# EAGLE design LIC_rack_backplane-01 (EAGLE 5.06)
AUTHOR: M. Petrilak; VERSION: 0.1

## Sheet 1 of 2
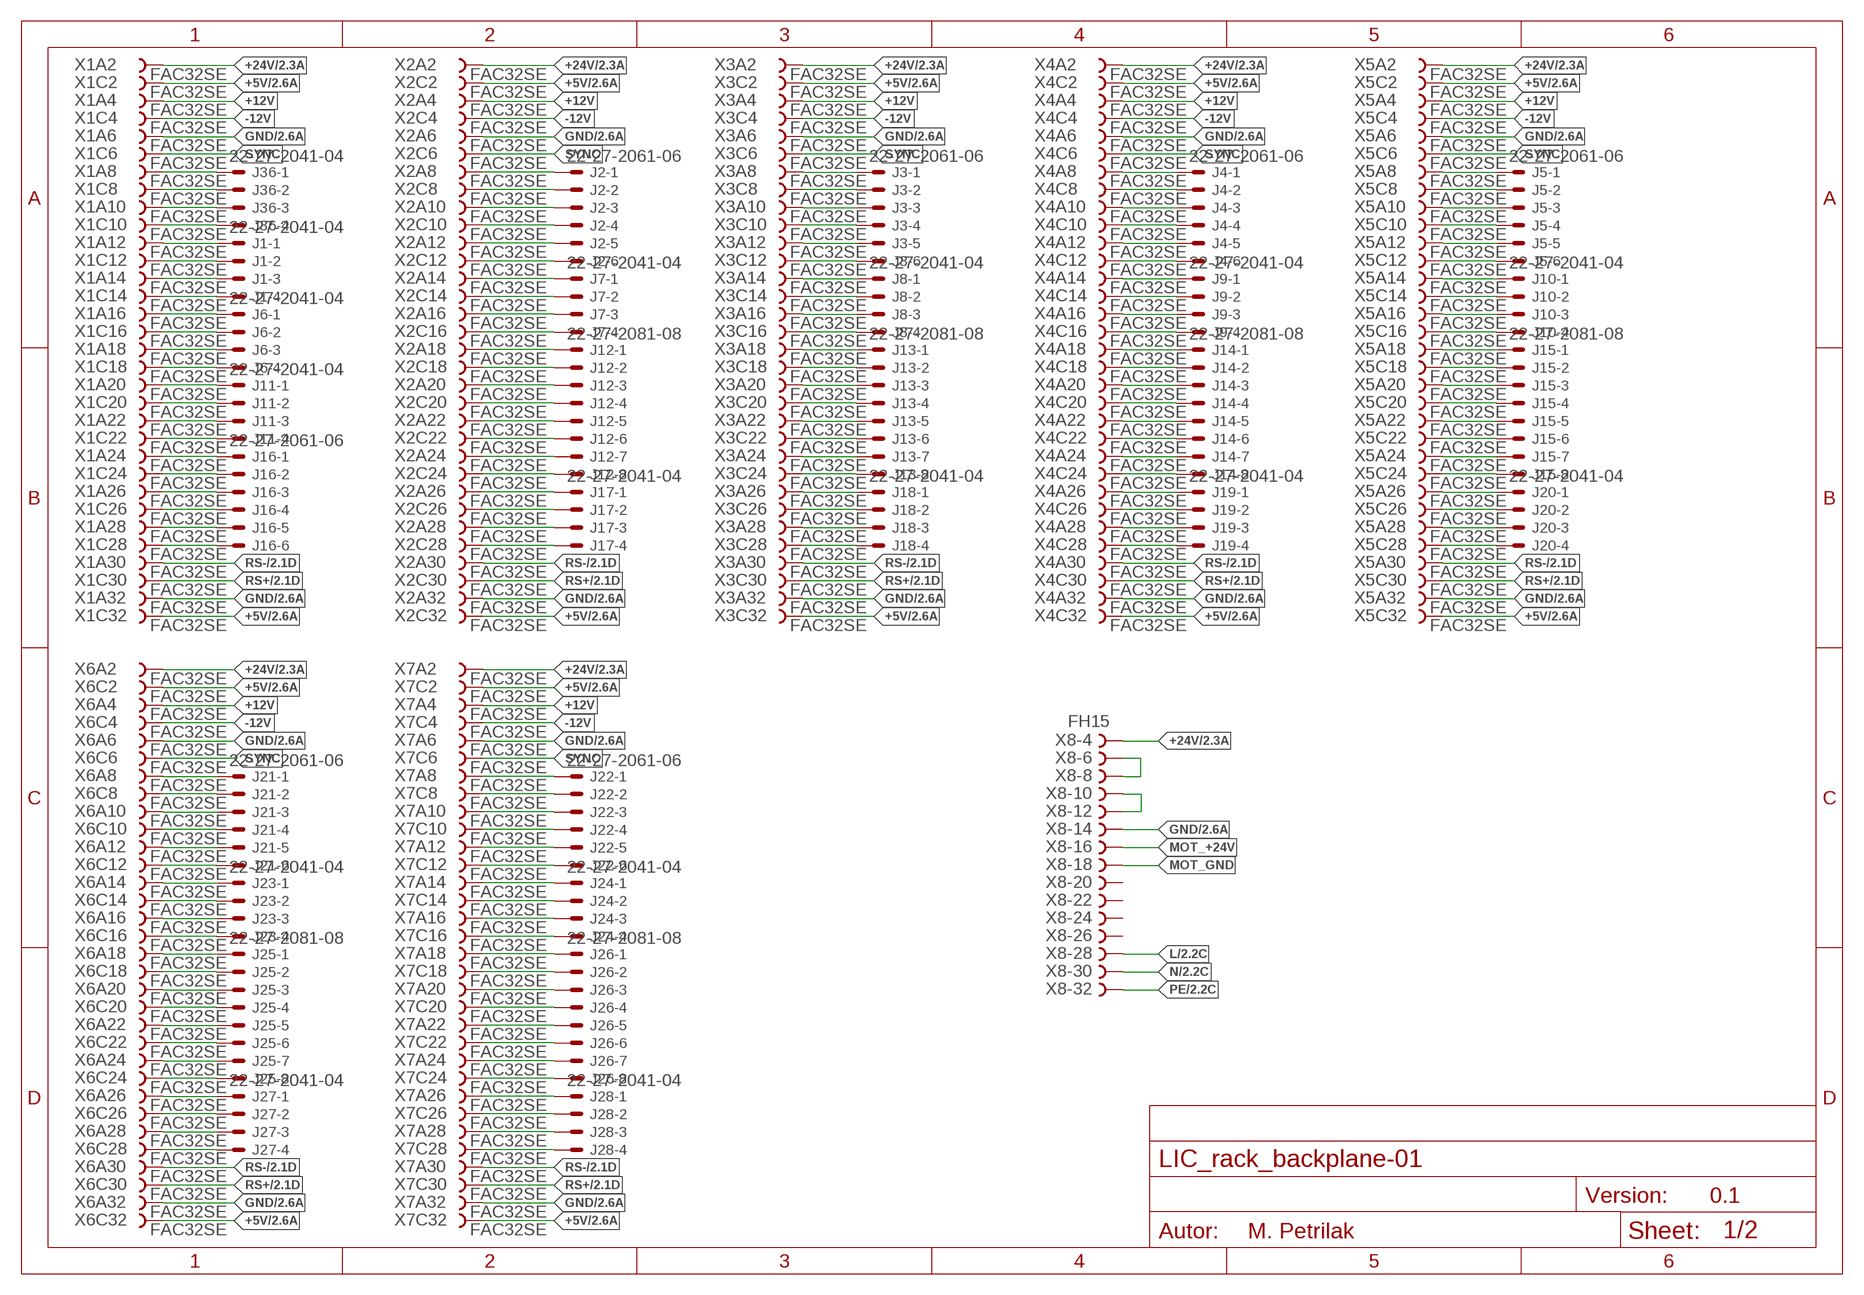
[diagram p0: schematic, sheet 1]

### Parts
J1  22-27-2041-04  [6410-04]
J2  22-27-2061-06  [6410-06]
J3  22-27-2061-06  [6410-06]
J4  22-27-2061-06  [6410-06]
J5  22-27-2061-06  [6410-06]
J6  22-27-2041-04  [6410-04]
J7  22-27-2041-04  [6410-04]
J8  22-27-2041-04  [6410-04]
J9  22-27-2041-04  [6410-04]
J10  22-27-2041-04  [6410-04]
J11  22-27-2041-04  [6410-04]
J12  22-27-2081-08  [6410-08]
J13  22-27-2081-08  [6410-08]
J14  22-27-2081-08  [6410-08]
J15  22-27-2081-08  [6410-08]
J16  22-27-2061-06  [6410-06]
J17  22-27-2041-04  [6410-04]
J18  22-27-2041-04  [6410-04]
J19  22-27-2041-04  [6410-04]
J20  22-27-2041-04  [6410-04]
J21  22-27-2061-06  [6410-06]
J22  22-27-2061-06  [6410-06]
J23  22-27-2041-04  [6410-04]
J24  22-27-2041-04  [6410-04]
J25  22-27-2081-08  [6410-08]
J26  22-27-2081-08  [6410-08]
J27  22-27-2041-04  [6410-04]
J28  22-27-2041-04  [6410-04]
J36  22-27-2041-04  [6410-04]
X1  FAC32SE  [FAC32S]
X2  FAC32SE  [FAC32S]
X3  FAC32SE  [FAC32S]
X4  FAC32SE  [FAC32S]
X5  FAC32SE  [FAC32S]
X6  FAC32SE  [FAC32S]
X7  FAC32SE  [FAC32S]
X8  FH15  [FH15]

### Nets
+5V: X1.C2 X1.C32 X2.C2 X2.C32 X3.C2 X3.C32 X4.C2 X4.C32 X5.C2 X5.C32 X6.C2 X6.C32 X7.C2 X7.C32 ; also sheet 2
+12V: X1.A4 X2.A4 X3.A4 X4.A4 X5.A4 X6.A4 X7.A4
+24V: X1.A2 X2.A2 X3.A2 X4.A2 X5.A2 X6.A2 X7.A2 X8.4 ; also sheet 2
-12V: X1.C4 X2.C4 X3.C4 X4.C4 X5.C4 X6.C4 X7.C4
GND: X1.A6 X1.A32 X2.A6 X2.A32 X3.A6 X3.A32 X4.A6 X4.A32 X5.A6 X5.A32 X6.A6 X6.A32 X7.A6 X7.A32 X8.14 ; also sheet 2
L [LNPE]: X8.28 ; also sheet 2
MOT_+24V: X8.16
MOT_GND: X8.18
N [LNPE]: X8.30 ; also sheet 2
N$1: X8.6 X8.8
N$2: X8.10 X8.12
N$3: J16.3 X1.A26
N$4: J16.4 X1.C26
N$5: J16.5 X1.A28
N$6: J2.1 X2.A8
N$7: J2.2 X2.C8
N$8: J2.3 X2.A10
N$9: J2.4 X2.C10
N$10: J2.5 X2.A12
N$11: J2.6 X2.C12
N$12: J7.1 X2.A14
N$13: J1.1 X1.A12
N$14: J1.2 X1.C12
N$15: J1.3 X1.A14
N$16: J1.4 X1.C14
N$17: J6.1 X1.A16
N$18: J13.2 X3.C18
N$19: J13.3 X3.A20
N$20: J13.4 X3.C20
N$21: J13.5 X3.A22
N$22: J13.6 X3.C22
N$23: J13.7 X3.A24
N$24: J13.8 X3.C24
N$25: J18.1 X3.A26
N$26: J18.2 X3.C26
N$27: J18.3 X3.A28
N$28: J18.4 X3.C28
N$29: J16.6 X1.C28
N$30: J36.1 X1.A8
N$31: J36.2 X1.C8
N$32: J36.3 X1.A10
N$33: J36.4 X1.C10
N$34: J6.2 X1.C16
N$35: J6.3 X1.A18
N$36: J6.4 X1.C18
N$37: J11.1 X1.A20
N$38: J11.2 X1.C20
N$39: J11.3 X1.A22
N$40: J11.4 X1.C22
N$41: J16.1 X1.A24
N$42: J16.2 X1.C24
N$43: J14.2 X4.C18
N$44: J14.3 X4.A20
N$45: J14.4 X4.C20
N$46: J14.5 X4.A22
N$47: J14.6 X4.C22
N$48: J14.7 X4.A24
N$49: J14.8 X4.C24
N$50: J19.1 X4.A26
N$51: J19.2 X4.C26
N$52: J19.3 X4.A28
N$53: J19.4 X4.C28
N$54: J15.2 X5.C18
N$55: J15.3 X5.A20
N$56: J15.4 X5.C20
N$57: J15.5 X5.A22
N$58: J15.6 X5.C22
N$59: J15.7 X5.A24
N$60: J15.8 X5.C24
N$61: J20.1 X5.A26
N$62: J20.2 X5.C26
N$63: J20.3 X5.A28
N$64: J20.4 X5.C28
N$65: J25.2 X6.C18
N$66: J25.3 X6.A20
N$67: J25.4 X6.C20
N$68: J25.5 X6.A22
N$69: J25.6 X6.C22
N$70: J25.7 X6.A24
N$71: J25.8 X6.C24
N$72: J27.1 X6.A26
N$73: J27.2 X6.C26
N$74: J27.3 X6.A28
N$75: J27.4 X6.C28
N$76: J7.2 X2.C14
N$77: J7.3 X2.A16
N$78: J7.4 X2.C16
N$79: J17.1 X2.A26
N$80: J17.2 X2.C26
N$81: J17.3 X2.A28
N$82: J17.4 X2.C28
N$83: J12.1 X2.A18
N$84: J12.2 X2.C18
N$85: J12.3 X2.A20
N$86: J12.4 X2.C20
N$87: J12.5 X2.A22
N$88: J12.6 X2.C22
N$89: J12.7 X2.A24
N$90: J12.8 X2.C24
N$99: J22.1 X7.A8
N$100: J22.2 X7.C8
N$101: J22.3 X7.A10
N$102: J22.4 X7.C10
N$103: J22.5 X7.A12
N$104: J22.6 X7.C12
N$105: J24.1 X7.A14
N$120: J24.2 X7.C14
N$121: J24.3 X7.A16
N$122: J24.4 X7.C16
N$123: J28.1 X7.A26
N$124: J28.2 X7.C26
N$125: J28.3 X7.A28
N$126: J28.4 X7.C28
N$127: J26.1 X7.A18
N$128: J26.2 X7.C18
N$129: J26.3 X7.A20
N$130: J26.4 X7.C20
N$131: J26.5 X7.A22
N$132: J26.6 X7.C22
N$133: J26.7 X7.A24
N$134: J26.8 X7.C24
PE [LNPE]: X8.32 ; also sheet 2
RS+: X1.C30 X2.C30 X3.C30 X4.C30 X5.C30 X6.C30 X7.C30 ; also sheet 2
RS-: X1.A30 X2.A30 X3.A30 X4.A30 X5.A30 X6.A30 X7.A30 ; also sheet 2
SYNC: X1.C6 X2.C6 X3.C6 X4.C6 X5.C6 X6.C6 X7.C6
U_01_01: J3.1 X3.A8
U_01_02: J3.2 X3.C8
U_01_03: J3.3 X3.A10
U_01_04: J3.4 X3.C10
U_01_05: J3.5 X3.A12
U_01_06: J3.6 X3.C12
U_01_07: J8.1 X3.A14
U_01_08: J8.2 X3.C14
U_01_09: J8.3 X3.A16
U_01_10: J8.4 X3.C16
U_01_11: J13.1 X3.A18
U_01_12: J4.1 X4.A8
U_01_13: J4.2 X4.C8
U_01_14: J4.3 X4.A10
U_01_15: J4.4 X4.C10
U_01_16: J4.5 X4.A12
U_01_17: J4.6 X4.C12
U_01_18: J9.1 X4.A14
U_01_19: J9.2 X4.C14
U_01_20: J9.3 X4.A16
U_01_21: J9.4 X4.C16
U_01_22: J14.1 X4.A18
U_01_23: J5.1 X5.A8
U_01_24: J5.2 X5.C8
U_01_25: J5.3 X5.A10
U_01_26: J5.4 X5.C10
U_01_27: J5.5 X5.A12
U_01_28: J5.6 X5.C12
U_01_29: J10.1 X5.A14
U_01_30: J10.2 X5.C14
U_01_31: J10.3 X5.A16
U_01_32: J10.4 X5.C16
U_01_33: J15.1 X5.A18
U_01_34: J21.1 X6.A8
U_01_35: J21.2 X6.C8
U_01_36: J21.3 X6.A10
U_01_37: J21.4 X6.C10
U_01_38: J21.5 X6.A12
U_01_39: J21.6 X6.C12
U_01_40: J23.1 X6.A14
U_01_41: J23.2 X6.C14
U_01_42: J23.3 X6.A16
U_01_43: J23.4 X6.C16
U_01_44: J25.1 X6.A18
Unconnected: X8.20 X8.22 X8.24 X8.26

## Sheet 2 of 2
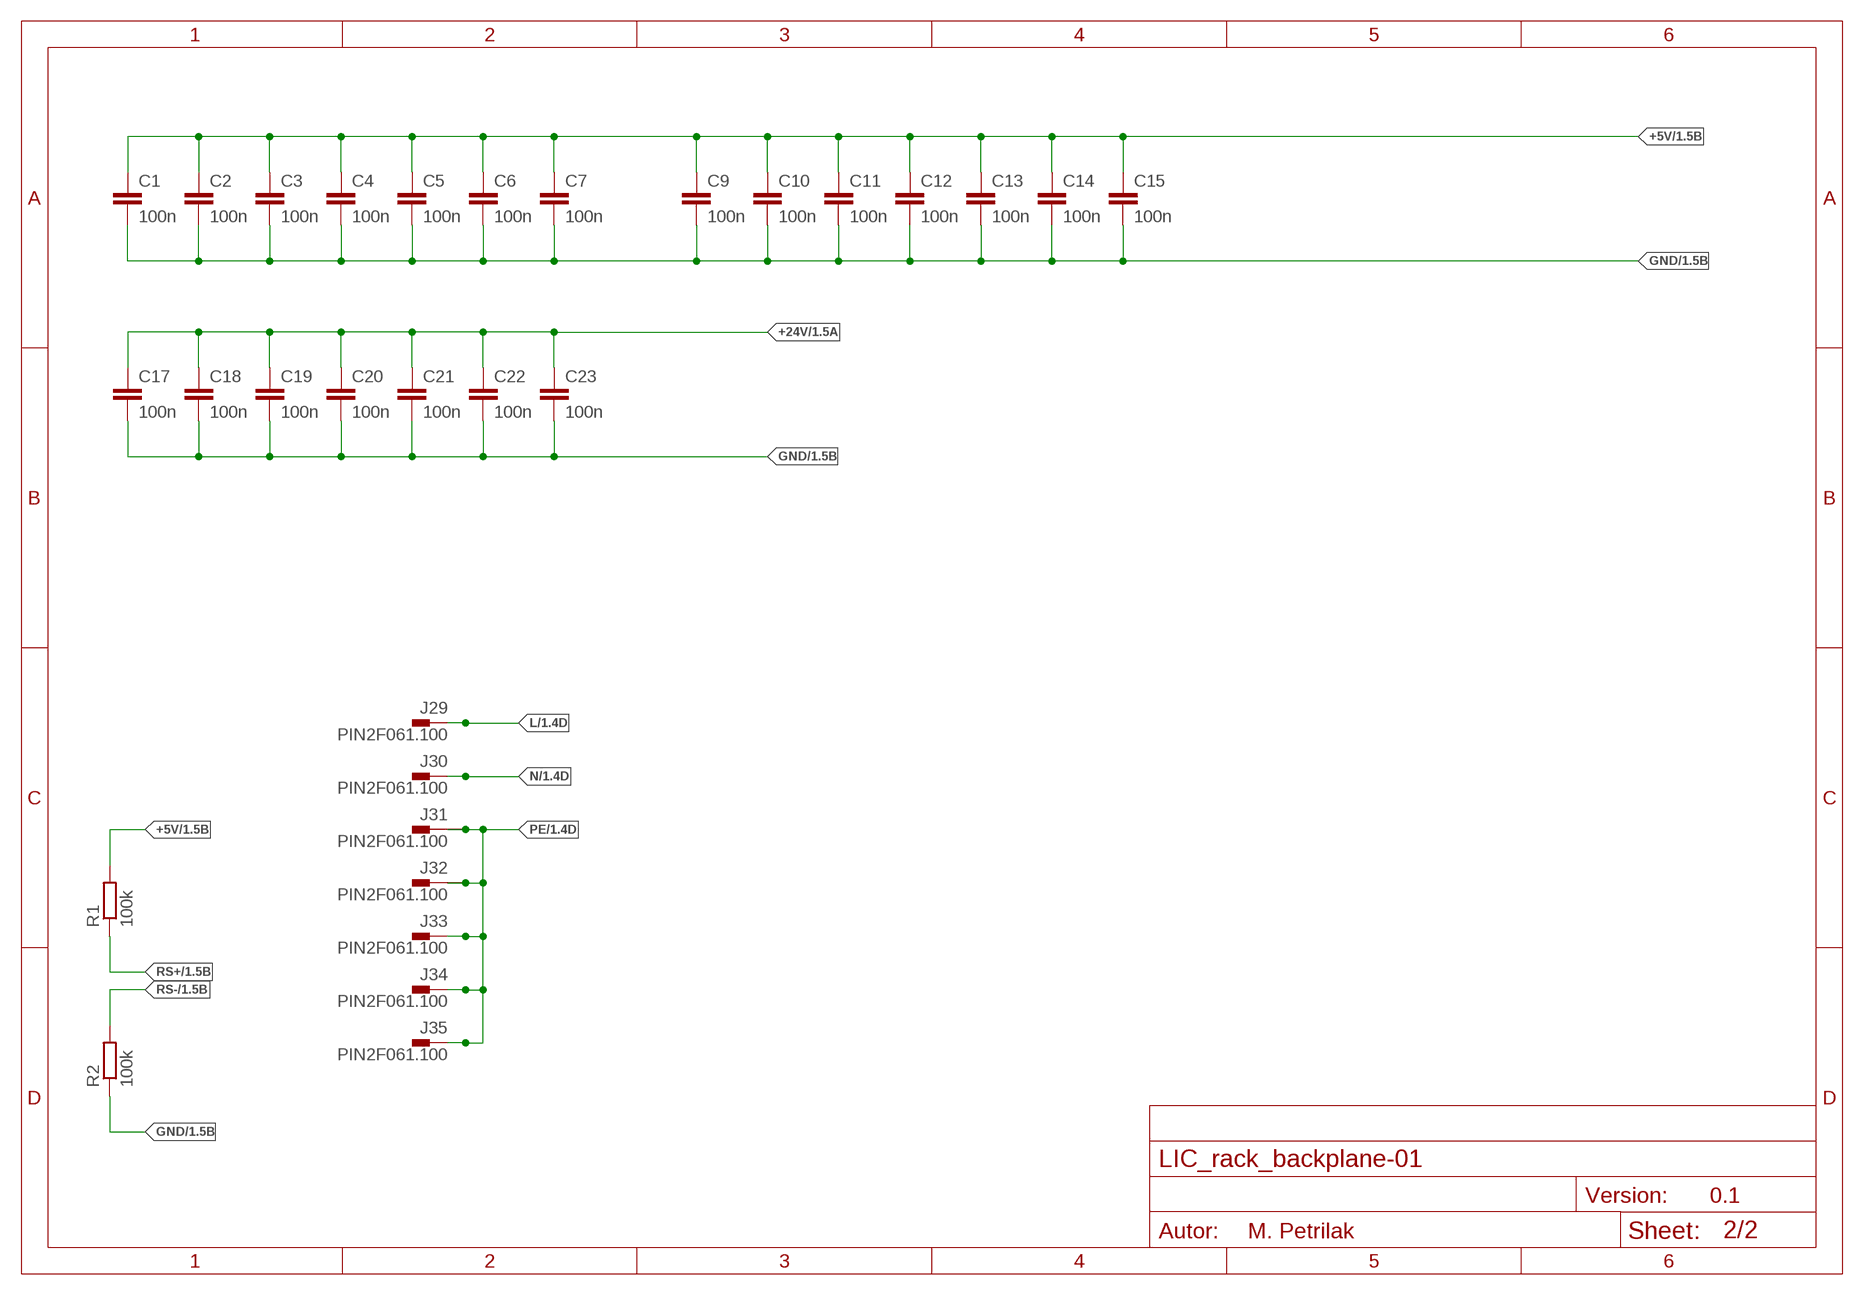
[diagram p1: schematic, sheet 2]

### Parts
C1  100n  C-EUC1206  [C1206]
C2  100n  C-EUC1206  [C1206]
C3  100n  C-EUC1206  [C1206]
C4  100n  C-EUC1206  [C1206]
C5  100n  C-EUC1206  [C1206]
C6  100n  C-EUC1206  [C1206]
C7  100n  C-EUC1206  [C1206]
C9  100n  C-EUC1206  [C1206]
C10  100n  C-EUC1206  [C1206]
C11  100n  C-EUC1206  [C1206]
C12  100n  C-EUC1206  [C1206]
C13  100n  C-EUC1206  [C1206]
C14  100n  C-EUC1206  [C1206]
C15  100n  C-EUC1206  [C1206]
C17  100n  C-EUC1206  [C1206]
C18  100n  C-EUC1206  [C1206]
C19  100n  C-EUC1206  [C1206]
C20  100n  C-EUC1206  [C1206]
C21  100n  C-EUC1206  [C1206]
C22  100n  C-EUC1206  [C1206]
C23  100n  C-EUC1206  [C1206]
J29  PIN2F061.100  [F061.100]
J30  PIN2F061.100  [F061.100]
J31  PIN2F061.100  [F061.100]
J32  PIN2F061.100  [F061.100]
J33  PIN2F061.100  [F061.100]
J34  PIN2F061.100  [F061.100]
J35  PIN2F061.100  [F061.100]
R1  100k  R-EU_R1206  [R1206]
R2  100k  R-EU_R1206  [R1206]

### Nets
+5V: C1.1 C2.1 C3.1 C4.1 C5.1 C6.1 C7.1 C9.1 C10.1 C11.1 C12.1 C13.1 C14.1 C15.1 R1.2 ; also sheet 1
+24V: C17.1 C18.1 C19.1 C20.1 C21.1 C22.1 C23.1 ; also sheet 1
GND: C1.2 C2.2 C3.2 C4.2 C5.2 C6.2 C7.2 C9.2 C10.2 C11.2 C12.2 C13.2 C14.2 C15.2 C17.2 C18.2 C19.2 C20.2 C21.2 C22.2 C23.2 R2.1 ; also sheet 1
L [LNPE]: J29.A1 J29.A2(1.1) ; also sheet 1
N [LNPE]: J30.A1 J30.A2(1.1) ; also sheet 1
PE [LNPE]: J31.A1 J31.A2(1.1) J32.A1 J32.A2(1.1) J33.A1 J33.A2(1.1) J34.A1 J34.A2(1.1) J35.A1 J35.A2(1.1) ; also sheet 1
RS+: R1.1 ; also sheet 1
RS-: R2.2 ; also sheet 1

## Library data of the parts
C1-C7 C9-C15 C17-C23 = rcl:C-EU: CAPACITOR, European symbol
J1 J6-J11 J17-J20 J23 J24 J27 J28 J36 = con-molex:22-?-04: CONNECTOR wire to board 2.54 mm (.1 inch) pitch header
J2-J5 J16 J21 J22 = con-molex:22-?-06: CONNECTOR wire to board 2.54 mm (.1 inch) pitch header
J12-J15 J25 J26 = con-molex:22-?-08: CONNECTOR wire to board 2.54 mm (.1 inch) pitch header
J29-J35 = con-faston:PIN2: Flachstecker Typ Tyco/Electronics/AMP TAB, FASTON Printed Circuit Board Tabs Source: http://www.buerklin.com, http://catalog.tycoelectronics.com
R1 R2 = rcl:R-EU_: RESISTOR, European symbol
X1-X7 = con-vg:FAC32SE: CONNECTOR female, 32 pins, single, type D, rows AC, grid 5.08 mm
X8 = con-vg:FH15: CONNECTOR female, 15 pins, type H, rows DZ

## Net classes
0 default: clearance 0.2 mm
1 LNPE: clearance 2.5 mm to class 0, clearance 1 mm

## Board
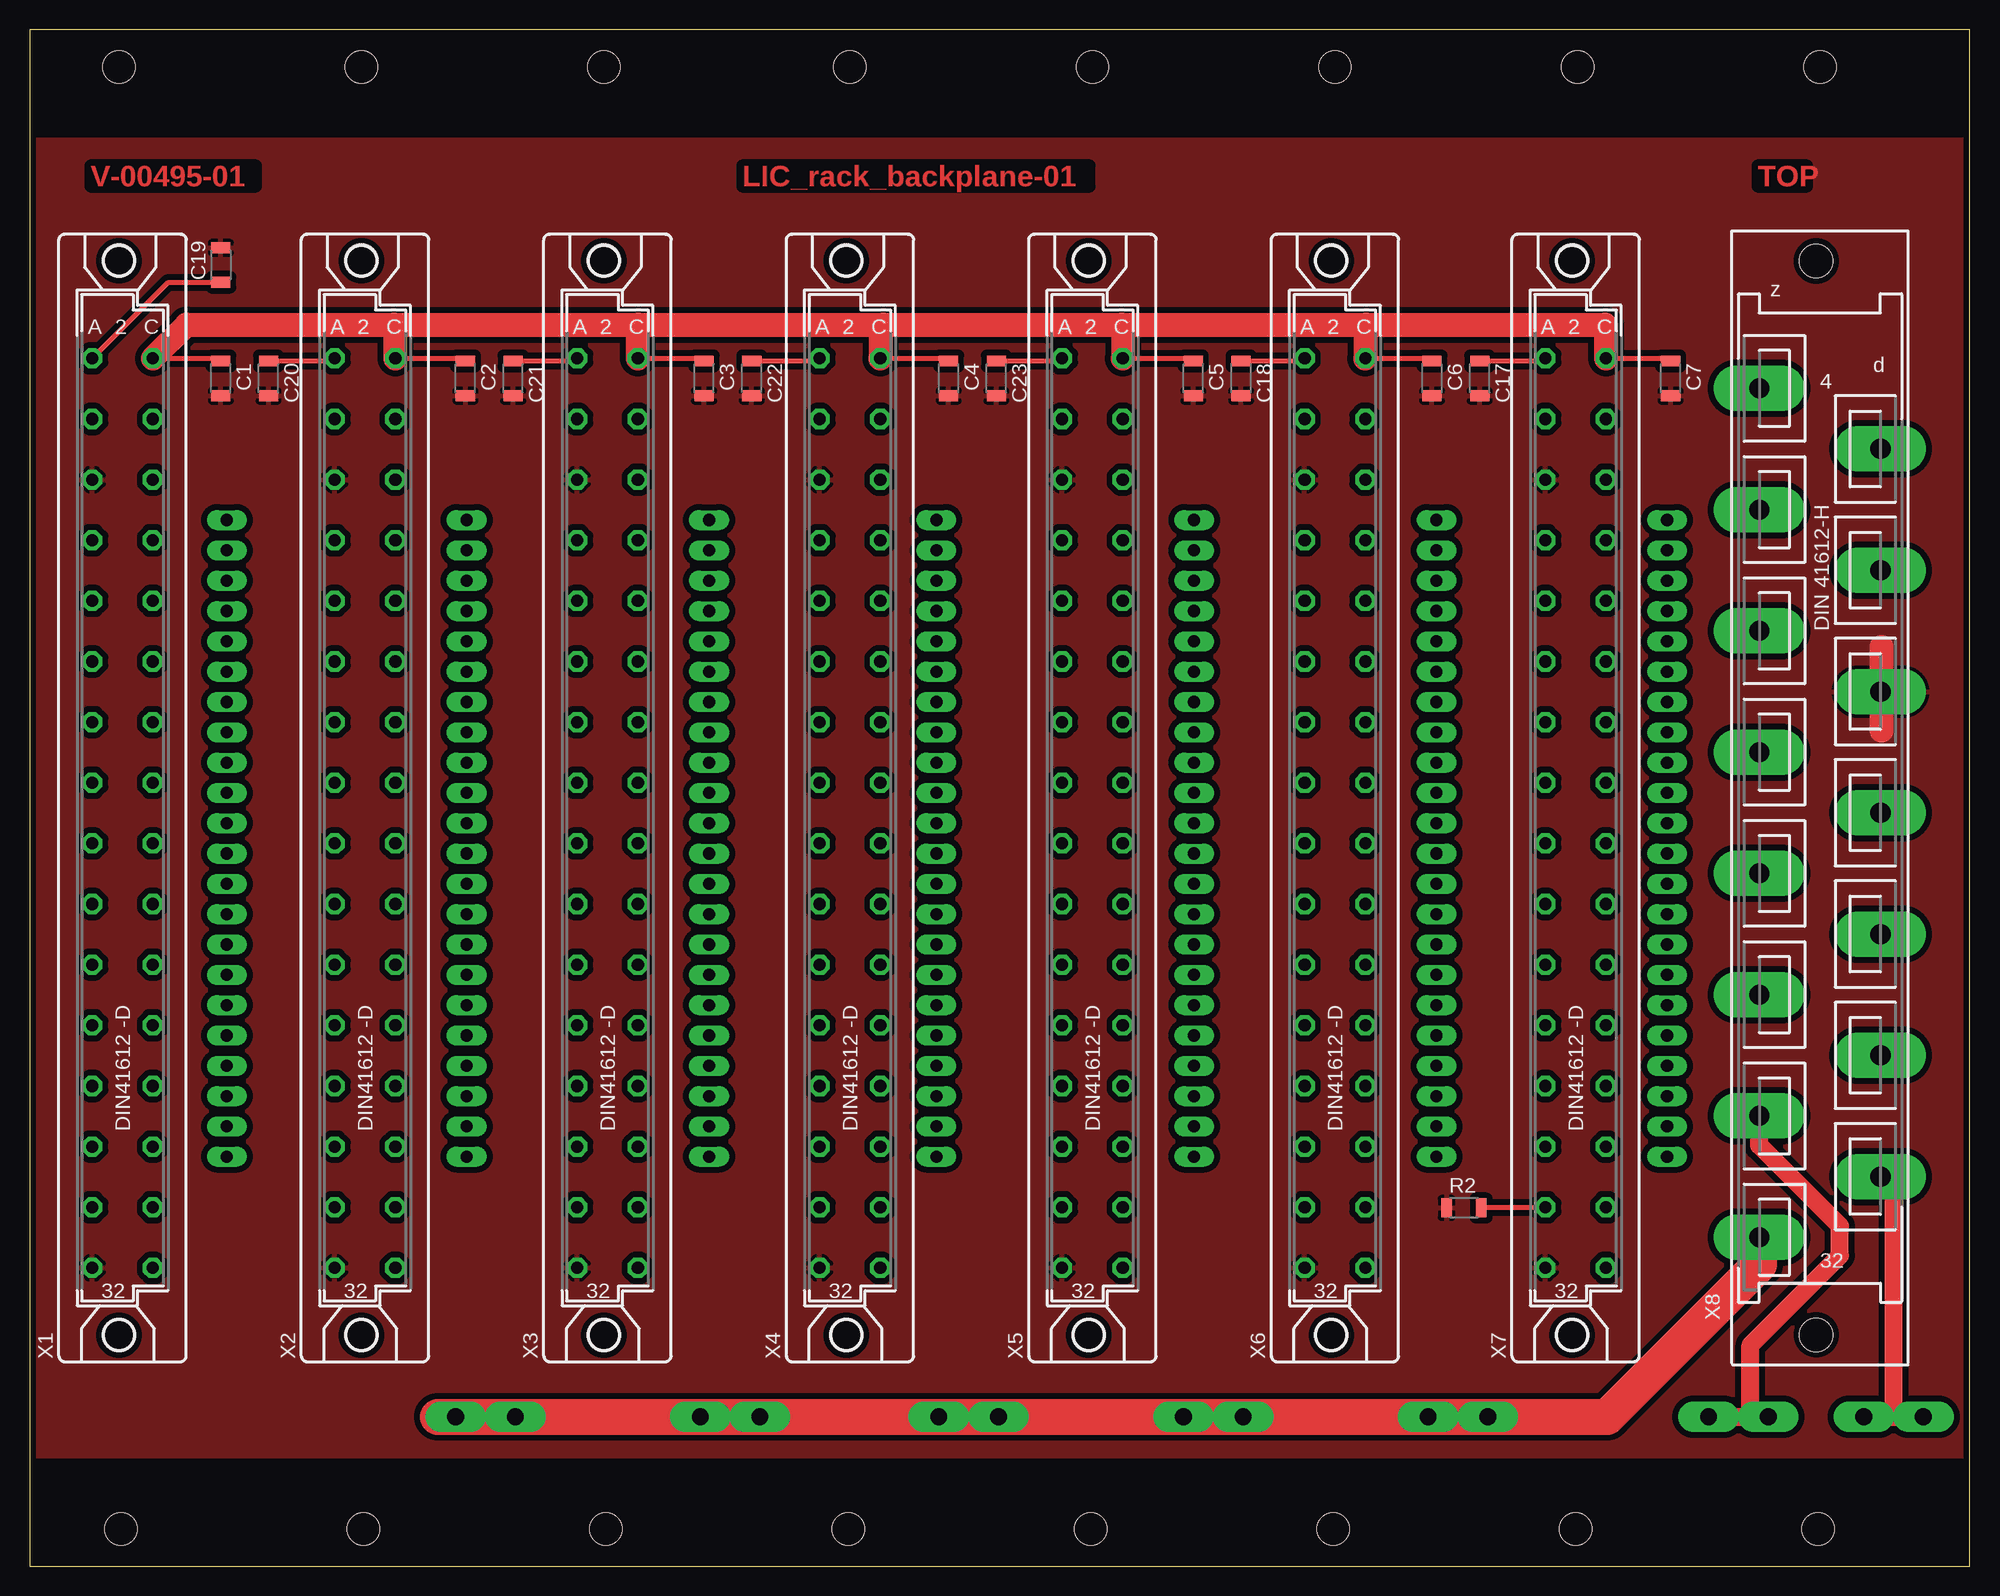
[diagram p2: board, top side]
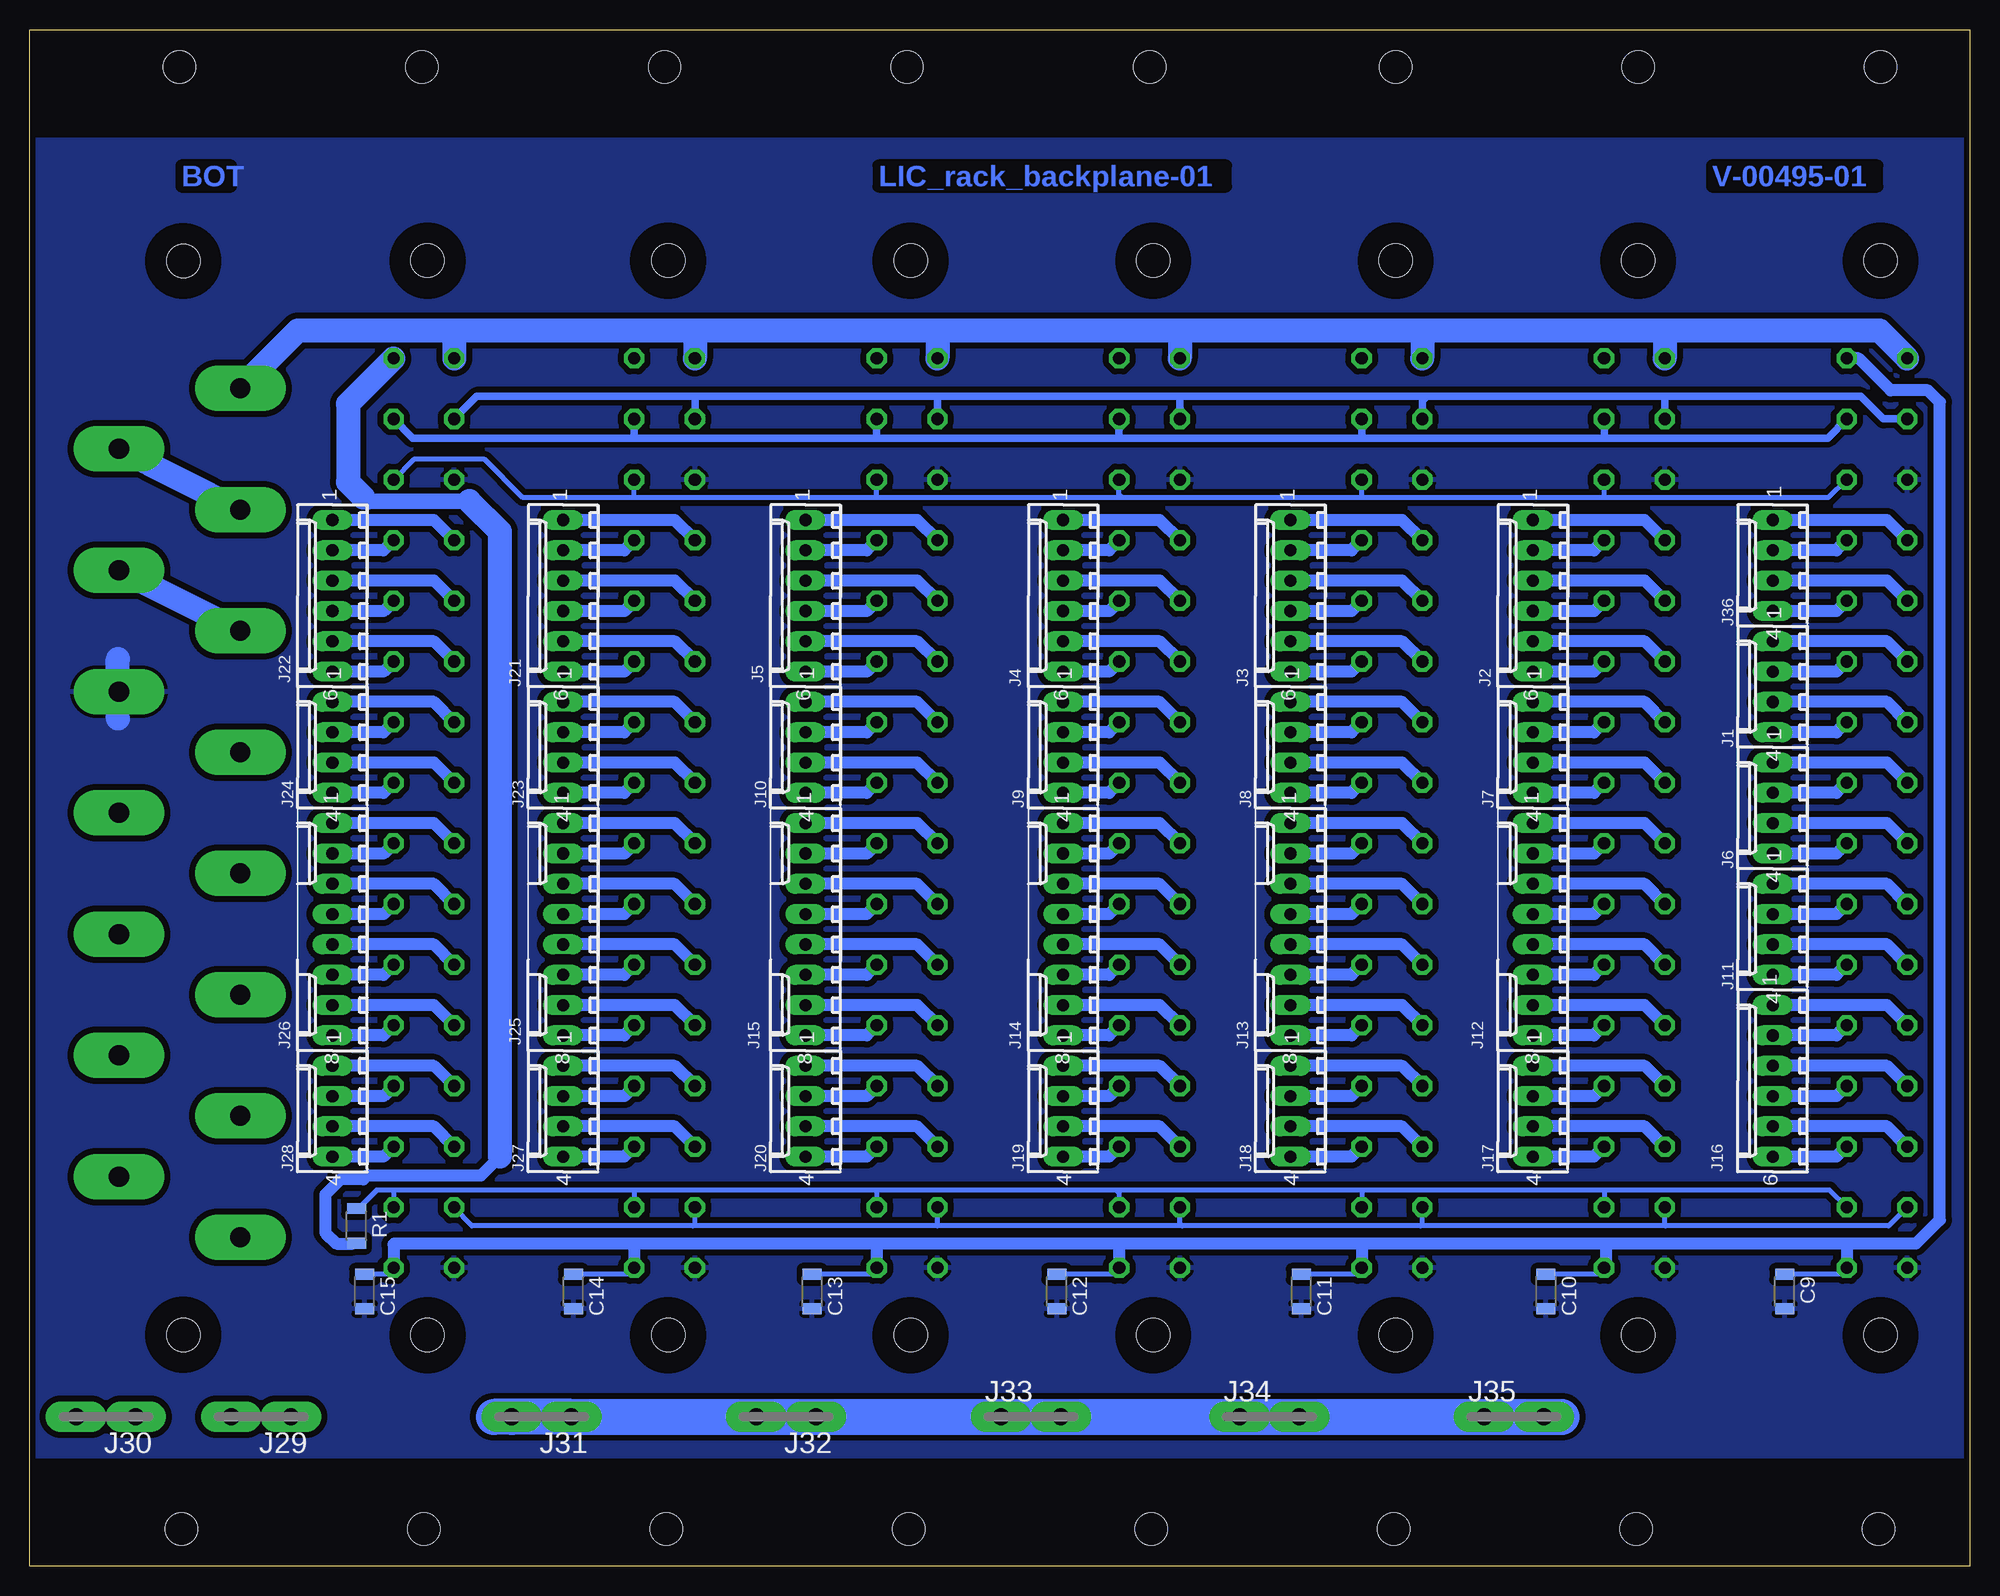
[diagram p3: board, bottom side, seen from below]

Size 162.56 x 128.7 mm. Coordinates in mm from the lower left corner, seen from the top.
Outline: 0,0 162.56,0 162.56,128.7 0,128.7 0,0
Copper layers (1*16): Top 0.04mm / dielectric 1.5mm / Bottom 0.04mm
Design rules "mucha_navrh *": minimum track width 0.2mm, minimum drill 0.6mm, track to track 0.5mm, track to pad 0.5mm, pad to pad 0.3mm, via to via 0.3mm, smd to smd 0mil, copper to edge 0.5mm, drill to drill 0.5mm, minimum pad ring 0.3mm, minimum via ring 0.3mm, stop-mask expansion 0.1mm, vias tented up to drill 0.8mm, thermal gap 0.3mm
Holes 2.7 mm at 7.47,125.6 27.79,125.6 48.11,125.6 68.73,125.6 7.62,3.1 89.05,125.6 109.37,125.6 129.69,125.6 150.01,125.6 27.94,3.1 48.26,3.1 68.58,3.1 88.9,3.1 109.22,3.1 129.54,3.1 149.86,3.1
tRestrict: area 0,119.7 to 182.9,128.7; area 0,0 to 182.9,9
bRestrict: area 0,119.7 to 182.9,128.7; area 0,0 to 182.9,9
vRestrict: area 0,119.7 to 182.9,128.7; area 0,0 to 182.9,9

### Footprints (pad centres in the part's own frame; a part is rotated, then mirrored left to right if it is on the bottom)
C1206 = smd 0.9 x 1.6: 1 -1.45,0; 2 1.45,0
6410-04 = drill 1.016 long: 1 3.81,0; 2 1.27,0; 3 -1.27,0; 4 -3.81,0
6410-06 = drill 1.016 long: 1 6.35,0; 2 3.81,0; 3 1.27,0; 4 -1.27,0; 5 -3.81,0; 6 -6.35,0
6410-08 = drill 1.016 long: 1 8.89,0; 2 6.35,0; 3 3.81,0; 4 1.27,0; 5 -1.27,0; 6 -3.81,0; 7 -6.35,0; 8 -8.89,0
F061.100 = drill 1.4 pad 2.54 long: A1 -2.5,0; A2 2.5,0
R1206 = smd 0.9 x 1.6: 1 -1.45,0; 2 1.45,0
FAC32S = drill 1.016 octagon: A2 -2.54,36.83; A4 -2.54,31.75; A6 -2.54,26.67; A8 -2.54,21.59; A10 -2.54,16.51; A12 -2.54,11.43; A14 -2.54,6.35; A16 -2.54,1.27; A18 -2.54,-3.81; A20 -2.54,-8.89; A22 -2.54,-13.97; A24 -2.54,-19.05; A26 -2.54,-24.13; A28 -2.54,-29.21; A30 -2.54,-34.29; A32 -2.54,-39.37; C2 2.54,36.83; C4 2.54,31.75; C6 2.54,26.67; C8 2.54,21.59; C10 2.54,16.51; C12 2.54,11.43; C14 2.54,6.35; C16 2.54,1.27; C18 2.54,-3.81; C20 2.54,-8.89; C22 2.54,-13.97; C24 2.54,-19.05; C26 2.54,-24.13; C28 2.54,-29.21; C30 2.54,-34.29; C32 2.54,-39.37 | hole 2.794: -0.305,45.009; -0.305,-45.009
FH15 = drill 1.676 pad 3.81 long: 4 -5.08,34.315; 6 5.08,29.235; 8 -5.08,24.155; 10 5.08,19.075; 12 -5.08,13.995; 14 5.08,8.915; 16 -5.08,3.835; 18 5.08,-1.245; 20 -5.08,-6.325; 22 5.08,-11.405; 24 -5.08,-16.485; 26 5.08,-21.565; 28 -5.08,-26.645; 30 5.08,-31.725; 32 -5.08,-36.805 | hole 2.794: -0.305,44.983; -0.305,-44.983

### Placement (x,y rotation side)
C1  16,99.5 270 top
C2  36.5,99.5 270 top
C3  56.5,99.5 270 top
C4  77,99.5 270 top
C5  97.5,99.5 270 top
C6  117.5,99.5 270 top
C7  137.5,99.5 270 top
C9  15.5,23 270 bottom
C10  35.5,23 270 bottom
C11  56,23 270 bottom
C12  76.5,23 270 bottom
C13  97,23 270 bottom
C14  117,23 270 bottom
C15  134.5,23 270 bottom
C17  121.5,99.5 270 top
C18  101.5,99.5 270 top
C19  16,109 90 top
C20  20,99.5 270 top
C21  40.5,99.5 270 top
C22  60.5,99.5 270 top
C23  81,99.5 270 top
J1  16.51,73.66 90 bottom
J2  36.6,81.28 90 bottom
J3  56.92,81.28 90 bottom
J4  75.97,81.28 90 bottom
J5  97.56,81.28 90 bottom
J6  16.51,63.5 90 bottom
J7  36.6,68.58 90 bottom
J8  56.92,68.58 90 bottom
J9  75.97,68.58 90 bottom
J10  97.56,68.58 90 bottom
J11  16.51,53.34 90 bottom
J12  36.6,53.34 90 bottom
J13  56.92,53.34 90 bottom
J14  75.97,53.34 90 bottom
J15  97.56,53.34 90 bottom
J16  16.51,40.64 90 bottom
J17  36.6,38.1 90 bottom
J18  56.92,38.1 90 bottom
J19  75.97,38.1 90 bottom
J20  97.56,38.1 90 bottom
J21  117.88,81.28 90 bottom
J22  137.2,81.28 90 bottom
J23  117.88,68.58 90 bottom
J24  137.2,68.58 90 bottom
J25  117.88,53.34 90 bottom
J26  137.2,53.34 90 bottom
J27  117.88,38.1 90 bottom
J28  137.2,38.1 90 bottom
J29  143.18,12.5 180 bottom
J30  156.18,12.5 180 bottom
J31  119.68,12.5 180 bottom
J32  99.18,12.5 180 bottom
J33  78.68,12.5 0 bottom
J34  58.68,12.5 0 bottom
J35  38.18,12.5 0 bottom
J36  16.51,83.82 90 bottom
R1  135.18,28.5 270 bottom
R2  120.18,30 0 top
X1  7.77,64.35 0 top
X2  28.09,64.35 0 top
X3  48.41,64.35 0 top
X4  68.73,64.35 0 top
X5  89.05,64.35 0 top
X6  109.37,64.35 0 top
X7  129.54,64.35 0 top
X8  150.01,64.35 0 top

### Tracks (layer width: path | path; a pad name or v marks a point on that pad's centre or on a via)
+5V
  Top 0.406: X7.C2 136.77,101.18 C7.1 | X6.C2 116.77,101.18 C6.1 | X5.C2 97.27,101.18 C5.1 | X4.C2 76.77,101.18 C4.1 | X3.C2 56.27,101.18 C3.1 | X2.C2 36.27,101.18 C2.1 | C1.1 15.77,101.18 X1.C2
  Top 2: X1.C2 13.13,104 30.5,104 | 30.5,104 51,104 | 51,104 71.5,104 | 71.5,104 91.5,104 | 91.5,104 112,104 | 112,104 132,104 132.08,103.92 X7.C2 | X6.C2 111.91,103.91 112,104 | X5.C2 91.59,103.91 91.5,104 | X4.C2 71.27,103.77 71.5,104 | X3.C2 50.95,103.95 51,104 | X2.C2 30.63,103.87 30.5,104
  Bottom 0.406: X7.C32 132.61,24.45 C15.1 | X6.C32 112.44,24.45 C14.1 | X5.C32 92.12,24.45 C13.1 | X4.C32 71.8,24.45 C12.1 | X3.C32 51.48,24.45 C11.1 | X2.C32 31.16,24.45 C10.1 | X1.C32 10.84,24.45 C9.1 | R1.2 135.05,27.05 135.5,27
  Bottom 1: X2.C32 30.5,25.11 30.5,27 | 30.5,27 51,27 | 51,27 71,27 | 71,27 91.5,27 | 91.5,27 112,27 | 112,27 132,27 132.08,26.92 X7.C32 | X5.C32 91.59,26.91 91.5,27 | X6.C32 111.91,26.91 112,27 | X4.C32 71.27,26.73 71,27 | X3.C32 50.95,26.95 51,27 | 10.5,27 4.5,27 2.5,29 2.5,97.5 3.5,98.5 6.63,98.5 9.31,101.18 X1.C2 | 10.5,27 30.5,27 | X1.C32 10.31,26.81 10.5,27 | 135.5,27 136.85,27 137.79,27.94 137.79,31.11 136.53,32.38 134.62,32.38 134.3,32.7 124.78,32.7 123.19,34.29
  Bottom 1.3: 134.3,89.22 125.73,89.22
  Bottom 1.5: 134.62,89.53 134.3,89.22
  Bottom 2: X7.C2 135.89,97.37 135.89,90.81 134.62,89.53 | 125.73,89.22 123.19,86.68 123.19,34.29
+12V
  Bottom 0.61: 25.5,98 9.13,98 7.23,96.1 X1.A4 | 25.5,98 45.5,98 | 45.5,98 66,98 | 66,98 86.5,98 | 86.5,98 107,98 | X2.A4 25.55,97.95 25.5,98 | X3.A4 45.87,97.63 45.5,98 | X4.A4 66.19,97.81 66,98 | X5.A4 86.51,97.99 86.5,98 | X6.A4 106.83,97.83 107,98 | 107,98 125.1,98 X7.A4
+24V
  Top 0.406: C17.1 126.77,100.95 X7.A2 | C18.1 106.6,100.95 X6.A2 | C23.1 86.28,100.95 X5.A2 | C22.1 65.96,100.95 X4.A2 | C21.1 45.64,100.95 X3.A2 | C20.1 25.32,100.95 X2.A2 | C19.1 11.6,107.55 X1.A2
  Bottom 2: 25.5,103.5 45.5,103.5 | 45.5,103.5 66,103.5 | 66,103.5 86.5,103.5 | 86.5,103.5 107,103.5 | 107,103.5 127,103.5 | X3.A2 45.87,103.13 45.5,103.5 | X2.A2 25.55,103.45 25.5,103.5 | X4.A2 66.19,103.31 66,103.5 | X5.A2 86.51,103.49 86.5,103.5 | X6.A2 106.83,103.33 107,103.5 | 127,103.5 X7.A2 | X8.4 140.09,103.5 127,103.5 | 25.5,103.5 7.55,103.5 X1.A2
-12V
  Bottom 0.61: X1.C4 11.91,94.5 30.5,94.5 | 30.5,94.5 51,94.5 | 51,94.5 71.5,94.5 | 71.5,94.5 91.5,94.5 | 91.5,94.5 112,94.5 | X6.C4 111.91,94.59 112,94.5 | X5.C4 91.59,94.59 91.5,94.5 | X4.C4 71.27,94.73 71.5,94.5 | X3.C4 50.95,94.55 51,94.5 | X2.C4 30.63,94.63 30.5,94.5 | 112,94.5 130.48,94.5 X7.C4
GND
  Top 2: 155.18,70 155.18,77
  Bottom 2: 155.18,71 155.18,76
  pour Bottom (rank 2): 0,0 162.56,0 162.56,128.7 0,128.7
  pour Top (rank 2): 0,0 162.56,0 162.56,128.7 0,128.7
L
  Top 1.5: X8.28 144.93,35.25 151.68,28.5 151.68,26 144.18,18.5 144.18,12.5 | J29.A1 144.18,12.5 | 144.18,12.5 J29.A2
N
  Top 1.5: J30.A1 156.18,12.5 | 156.18,12.5 J30.A2 | X8.30 156.18,31.54 156.18,12.5
N$1
  Bottom 2: X8.8 X8.6
N$2
  Bottom 2: X8.12 X8.10
N$3
  Bottom 1: J16.3 6.92,41.91 X1.A26
N$4
  Bottom 1: J16.4 11.16,39.37 X1.C26
N$5
  Bottom 1: J16.5 6.92,36.83 X1.A28
N$6
  Bottom 1: J2.1 27.24,87.63 X2.A8
N$7
  Bottom 1: J2.2 31.48,85.09 X2.C8
N$8
  Bottom 1: J2.3 27.24,82.55 X2.A10
N$9
  Bottom 1: J2.4 31.48,80.01 X2.C10
N$10
  Bottom 1: J2.5 27.24,77.47 X2.A12
N$11
  Bottom 1: J2.6 31.48,74.93 X2.C12
N$12
  Bottom 1: J7.1 27.24,72.39 X2.A14
N$13
  Bottom 1: J1.1 6.92,77.47 X1.A12
N$14
  Bottom 1: J1.2 11.16,74.93 X1.C12
N$15
  Bottom 1: J1.3 6.92,72.39 X1.A14
N$16
  Bottom 1: J1.4 11.16,69.85 X1.C14
N$17
  Bottom 1: J6.1 6.92,67.31 X1.A16
N$18
  Bottom 1: J13.2 51.8,59.69 X3.C18
N$19
  Bottom 1: J13.3 47.56,57.15 X3.A20
N$20
  Bottom 1: J13.4 51.8,54.61 X3.C20
N$21
  Bottom 1: J13.5 47.56,52.07 X3.A22
N$22
  Bottom 1: J13.6 51.8,49.53 X3.C22
N$23
  Bottom 1: J13.7 47.56,46.99 X3.A24
N$24
  Bottom 1: J13.8 51.8,44.45 X3.C24
N$25
  Bottom 1: J18.1 47.56,41.91 X3.A26
N$26
  Bottom 1: J18.2 51.8,39.37 X3.C26
N$27
  Bottom 1: J18.3 47.56,36.83 X3.A28
N$28
  Bottom 1: J18.4 51.8,34.29 X3.C28
N$29
  Bottom 1: J16.6 11.16,34.29 X1.C28
N$30
  Bottom 1: J36.1 6.92,87.63 X1.A8
N$31
  Bottom 1: J36.2 11.16,85.09 X1.C8
N$32
  Bottom 1: J36.3 6.92,82.55 X1.A10
N$33
  Bottom 1: J36.4 11.16,80.01 X1.C10
N$34
  Bottom 1: J6.2 11.16,64.77 X1.C16
N$35
  Bottom 1: J6.3 6.92,62.23 X1.A18
N$36
  Bottom 1: J6.4 11.16,59.69 X1.C18
N$37
  Bottom 1: J11.1 6.92,57.15 X1.A20
N$38
  Bottom 1: J11.2 11.16,54.61 X1.C20
N$39
  Bottom 1: J11.3 6.92,52.07 X1.A22
N$40
  Bottom 1: J11.4 11.16,49.53 X1.C22
N$41
  Bottom 1: J16.1 6.92,46.99 X1.A24
N$42
  Bottom 1: J16.2 11.16,44.45 X1.C24
N$43
  Bottom 1: J14.2 72.12,59.69 X4.C18
N$44
  Bottom 1: J14.3 67.88,57.15 X4.A20
N$45
  Bottom 1: J14.4 72.12,54.61 X4.C20
N$46
  Bottom 1: J14.5 67.88,52.07 X4.A22
N$47
  Bottom 1: J14.6 72.12,49.53 X4.C22
N$48
  Bottom 1: J14.7 67.88,46.99 X4.A24
N$49
  Bottom 1: J14.8 72.12,44.45 X4.C24
N$50
  Bottom 1: J19.1 67.88,41.91 X4.A26
N$51
  Bottom 1: J19.2 72.12,39.37 X4.C26
N$52
  Bottom 1: J19.3 67.88,36.83 X4.A28
N$53
  Bottom 1: J19.4 72.12,34.29 X4.C28
N$54
  Bottom 1: J15.2 92.44,59.69 X5.C18
N$55
  Bottom 1: J15.3 88.2,57.15 X5.A20
N$56
  Bottom 1: J15.4 92.44,54.61 X5.C20
N$57
  Bottom 1: J15.5 88.2,52.07 X5.A22
N$58
  Bottom 1: J15.6 92.44,49.53 X5.C22
N$59
  Bottom 1: J15.7 88.2,46.99 X5.A24
N$60
  Bottom 1: J15.8 92.44,44.45 X5.C24
N$61
  Bottom 1: J20.1 88.2,41.91 X5.A26
N$62
  Bottom 1: J20.2 92.44,39.37 X5.C26
N$63
  Bottom 1: J20.3 88.2,36.83 X5.A28
N$64
  Bottom 1: J20.4 92.44,34.29 X5.C28
N$65
  Bottom 1: J25.2 112.76,59.69 X6.C18
N$66
  Bottom 1: J25.3 108.52,57.15 X6.A20
N$67
  Bottom 1: J25.4 112.76,54.61 X6.C20
N$68
  Bottom 1: J25.5 108.52,52.07 X6.A22
N$69
  Bottom 1: J25.6 112.76,49.53 X6.C22
N$70
  Bottom 1: J25.7 108.52,46.99 X6.A24
N$71
  Bottom 1: J25.8 112.76,44.45 X6.C24
N$72
  Bottom 1: J27.1 108.52,41.91 X6.A26
N$73
  Bottom 1: J27.2 112.76,39.37 X6.C26
N$74
  Bottom 1: J27.3 108.52,36.83 X6.A28
N$75
  Bottom 1: J27.4 112.76,34.29 X6.C28
N$76
  Bottom 1: J7.2 31.48,69.85 X2.C14
N$77
  Bottom 1: J7.3 27.24,67.31 X2.A16
N$78
  Bottom 1: J7.4 31.48,64.77 X2.C16
N$79
  Bottom 1: J17.1 27.24,41.91 X2.A26
N$80
  Bottom 1: J17.2 31.48,39.37 X2.C26
N$81
  Bottom 1: J17.3 27.24,36.83 X2.A28
N$82
  Bottom 1: J17.4 31.48,34.29 X2.C28
N$83
  Bottom 1: J12.1 27.24,62.23 X2.A18
N$84
  Bottom 1: J12.2 31.48,59.69 X2.C18
N$85
  Bottom 1: J12.3 27.24,57.15 X2.A20
N$86
  Bottom 1: J12.4 31.48,54.61 X2.C20
N$87
  Bottom 1: J12.5 27.24,52.07 X2.A22
N$88
  Bottom 1: J12.6 31.48,49.53 X2.C22
N$89
  Bottom 1: J12.7 27.24,46.99 X2.A24
N$90
  Bottom 1: J12.8 31.48,44.45 X2.C24
N$99
  Bottom 1: J22.1 128.69,87.63 X7.A8
N$100
  Bottom 1: J22.2 132.93,85.09 X7.C8
N$101
  Bottom 1: J22.3 128.69,82.55 X7.A10
N$102
  Bottom 1: J22.4 132.93,80.01 X7.C10
N$103
  Bottom 1: J22.5 128.69,77.47 X7.A12
N$104
  Bottom 1: J22.6 132.93,74.93 X7.C12
N$105
  Bottom 1: J24.1 128.69,72.39 X7.A14
N$120
  Bottom 1: J24.2 132.93,69.85 X7.C14
N$121
  Bottom 1: J24.3 128.69,67.31 X7.A16
N$122
  Bottom 1: J24.4 132.93,64.77 X7.C16
N$123
  Bottom 1: J28.1 128.69,41.91 X7.A26
N$124
  Bottom 1: J28.2 132.93,39.37 X7.C26
N$125
  Bottom 1: J28.3 128.69,36.83 X7.A28
N$126
  Bottom 1: J28.4 132.93,34.29 X7.C28
N$127
  Bottom 1: J26.1 128.69,62.23 X7.A18
N$128
  Bottom 1: J26.2 132.93,59.69 X7.C18
N$129
  Bottom 1: J26.3 128.69,57.15 X7.A20
N$130
  Bottom 1: J26.4 132.93,54.61 X7.C20
N$131
  Bottom 1: J26.5 128.69,52.07 X7.A22
N$132
  Bottom 1: J26.6 132.93,49.53 X7.C22
N$133
  Bottom 1: J26.7 128.69,46.99 X7.A24
N$134
  Bottom 1: J26.8 132.93,44.45 X7.C24
PE
  Top 3: X8.32 144.93,25.25 132.18,12.5 J31.A2 J31.A1 34.18,12.5
  Bottom 3: 34.18,12.5 J35.A2 J35.A1 J34.A2 J34.A1 J33.A2 J33.A1 J32.A1 J32.A2 J31.A1 J31.A2 123.68,12.5
RS+
  Bottom 0.406: 30.5,31.5 11.75,31.5 X1.C30 | 30.5,31.5 51,31.5 | 51,31.5 71.5,31.5 | 71.5,31.5 91.5,31.5 | 91.5,31.5 112,31.5 | 112,31.5 132,31.5 | 132,31.5 133.5,31.5 135.05,29.95 R1.1 | X2.C30 30.63,31.37 30.5,31.5 | X3.C30 50.95,31.45 51,31.5 | X4.C30 71.27,31.27 71.5,31.5 | X6.C30 111.91,31.41 112,31.5 | X7.C30 132.08,31.42 132,31.5 | X5.C30 91.59,31.41 91.5,31.5
RS-
  Top 0.406: R2.2 126.94,30 X7.A30
  Bottom 0.406: X1.A30 6.79,28.5 25.5,28.5 | 25.5,28.5 46,28.5 | 46,28.5 66,28.5 | 66,28.5 86.5,28.5 | 86.5,28.5 107,28.5 | 107,28.5 125.5,28.5 X7.A30 | X2.A30 25.55,28.55 25.5,28.5 | X3.A30 45.87,28.63 46,28.5 | X5.A30 86.51,28.51 86.5,28.5 | X6.A30 106.83,28.67 107,28.5 | X4.A30 66.19,28.69 66,28.5
SYNC
  Bottom 0.406: X1.C6 11.83,89.5 30.5,89.5 | 30.5,89.5 51,89.5 | 51,89.5 71,89.5 | 71,89.5 91.5,89.5 | 91.5,89.5 112,89.5 | X6.C6 111.91,89.59 112,89.5 | X5.C6 91.59,89.59 91.5,89.5 | X4.C6 71.27,89.77 71,89.5 | X3.C6 50.95,89.55 51,89.5 | X2.C6 30.63,89.63 30.5,89.5 | 112,89.5 121.25,89.5 124.46,92.71 130.39,92.71 X7.C6
U_01_01
  Bottom 1: X3.A8 47.56,87.63 J3.1
U_01_02
  Bottom 1: X3.C8 51.8,85.09 J3.2
U_01_03
  Bottom 1: X3.A10 47.56,82.55 J3.3
U_01_04
  Bottom 1: J3.4 51.8,80.01 X3.C10
U_01_05
  Bottom 1: J3.5 47.56,77.47 X3.A12
U_01_06
  Bottom 1: J3.6 51.8,74.93 X3.C12
U_01_07
  Bottom 1: J8.1 47.56,72.39 X3.A14
U_01_08
  Bottom 1: J8.2 51.8,69.85 X3.C14
U_01_09
  Bottom 1: J8.3 47.56,67.31 X3.A16
U_01_10
  Bottom 1: J8.4 51.8,64.77 X3.C16
U_01_11
  Bottom 1: J13.1 47.56,62.23 X3.A18
U_01_12
  Bottom 1: J4.1 67.88,87.63 X4.A8
U_01_13
  Bottom 1: J4.2 72.12,85.09 X4.C8
U_01_14
  Bottom 1: J4.3 67.88,82.55 X4.A10
U_01_15
  Bottom 1: J4.4 72.12,80.01 X4.C10
U_01_16
  Bottom 1: J4.5 67.88,77.47 X4.A12
U_01_17
  Bottom 1: J4.6 72.12,74.93 X4.C12
U_01_18
  Bottom 1: J9.1 67.88,72.39 X4.A14
U_01_19
  Bottom 1: J9.2 72.12,69.85 X4.C14
U_01_20
  Bottom 1: J9.3 67.88,67.31 X4.A16
U_01_21
  Bottom 1: J9.4 72.12,64.77 X4.C16
U_01_22
  Bottom 1: J14.1 67.88,62.23 X4.A18
U_01_23
  Bottom 1: J5.1 88.2,87.63 X5.A8
U_01_24
  Bottom 1: J5.2 92.44,85.09 X5.C8
U_01_25
  Bottom 1: J5.3 88.2,82.55 X5.A10
U_01_26
  Bottom 1: J5.4 92.44,80.01 X5.C10
U_01_27
  Bottom 1: J5.5 88.2,77.47 X5.A12
U_01_28
  Bottom 1: J5.6 92.44,74.93 X5.C12
U_01_29
  Bottom 1: J10.1 88.2,72.39 X5.A14
U_01_30
  Bottom 1: J10.2 92.44,69.85 X5.C14
U_01_31
  Bottom 1: J10.3 88.2,67.31 X5.A16
U_01_32
  Bottom 1: J10.4 92.44,64.77 X5.C16
U_01_33
  Bottom 1: J15.1 88.2,62.23 X5.A18
U_01_34
  Bottom 1: J21.1 108.52,87.63 X6.A8
U_01_35
  Bottom 1: J21.2 112.76,85.09 X6.C8
U_01_36
  Bottom 1: J21.3 108.52,82.55 X6.A10
U_01_37
  Bottom 1: J21.4 112.76,80.01 X6.C10
U_01_38
  Bottom 1: J21.5 108.52,77.47 X6.A12
U_01_39
  Bottom 1: J21.6 112.76,74.93 X6.C12
U_01_40
  Bottom 1: J23.1 108.52,72.39 X6.A14
U_01_41
  Bottom 1: J23.2 112.76,69.85 X6.C14
U_01_42
  Bottom 1: J23.3 108.52,67.31 X6.A16
U_01_43
  Bottom 1: J23.4 112.76,64.77 X6.C16
U_01_44
  Bottom 1: J25.1 108.52,62.23 X6.A18

### Text on the board
Top: V-00495-01 | LIC_rack_backplane-01 | TOP
Bottom: V-00495-01 | LIC_rack_backplane-01 | BOT